# Altium schematic sheet Hex_Multiplier.SchDoc
size A; Organization: Altium Limited; Address1: L3, 12a Rodborough Rd; Address2: Frenchs Forest; Address3: NSW; Address4: Australia 2086; DocumentNumber: 1; SheetNumber: 1; SheetTotal: 1
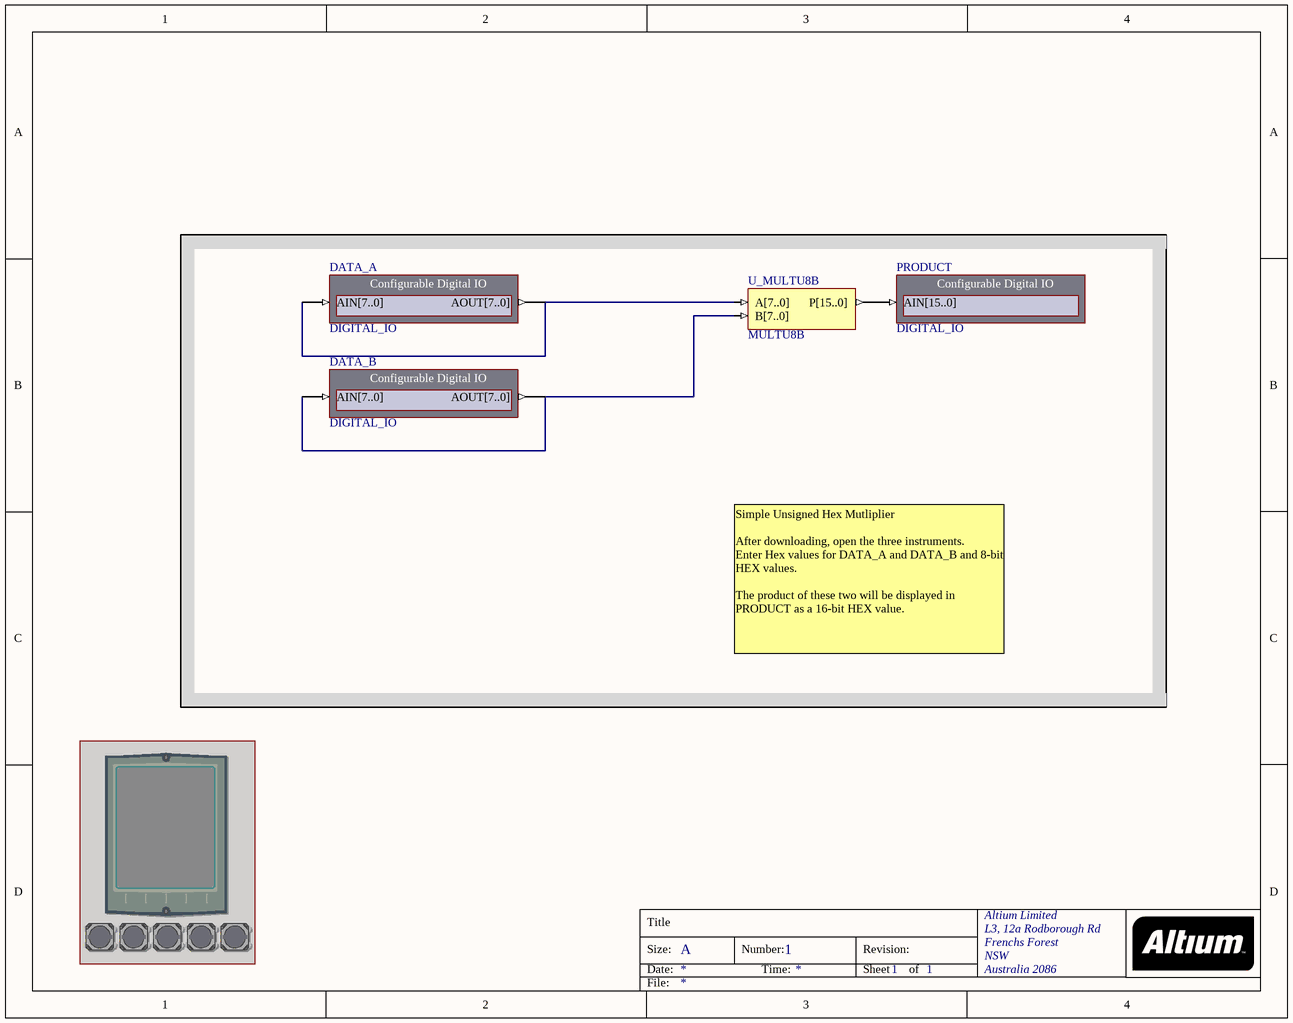
[diagram p0: Hex_Multiplier.SchDoc]

## Parts
(Parts that share a designator on the sheet are numbered #1, #2 ... from top to bottom, then left to right.)
?#1  FIRMWARE_TFT_ENABLE  (value not drawn)  (masked out: inside a compile mask, not in the netlist)
?#2  FIRMWARE_BUTTONS_ENABLE  (value not drawn)  (masked out: inside a compile mask, not in the netlist)
DATA_A  DIGITAL_IO
DATA_B  DIGITAL_IO
PRODUCT  DIGITAL_IO
U_MULTU8B  MULTU8B

## Nets
NetDATA_A_AIN[7..0]: DATA_A.AIN[7..0] DATA_A.AOUT[7..0] U_MULTU8B.A[7..0]
NetDATA_B_AIN[7..0]: DATA_B.AIN[7..0] DATA_B.AOUT[7..0] U_MULTU8B.B[7..0]
NetPRODUCT_AIN[15..0]: PRODUCT.AIN[15..0] U_MULTU8B.P[15..0]

## Notes on the sheet
- Simple Unsigned Hex Mutliplier
  After downloading, open the three instruments.
  Enter Hex values for DATA_A and DATA_B and 8-bit HEX values.
  The product of these two will be displayed in PRODUCT as a 16-bit HEX value.
- Title
- Size:
- Date:
- A
- Number:
- Time:
- Revision:
- Sheet
- of
- File:

## Library data of the parts
?#1 = FIRMWARE_TFT_ENABLE: TFT LCD Panel; PortComponent: True; Published: 22-Jan-2007; Publisher: Altium Limited; HelpURL: TR0143 Technical Reference Manual for Altium's Desktop NanoBoard NB2DSK01.pdf#page=50
?#2 = FIRMWARE_BUTTONS_ENABLE: Generic User Buttons; PortComponent: True; Published: 16-Apr-2007; Publisher: Altium Limited; HelpURL: TR0143 Technical Reference Manual for Altium's Desktop NanoBoard NB2DSK01.pdf#page=53
DATA_A DATA_B = DIGITAL_IO: Configurable Digital IO; NEXUS_CORE: Instrument; NEXUS_JTAG_DEVICE: True; NEXUS_JTAG_ORDER: 0; ConfigurationParameters: {}Version[1.0]{}Input0Name[AIN{1}7..0{2}]{}Input0Width[8]{}Input0InitValue[0]{}Input0Kind[LEDs]{}Input0LEDStyle[Red]{}Output0Name[AOUT{1}7..0{2}]{}Output0Width[8]{}Output0InitValue[0]{}Output0Kind[Numeric]{}Output0NumRadix[Binary]{}; ConfiguratorName: DIGITAL_IO; ComponentLink1Description: Core &Resource Usage; ComponentLink1URL: CR0134 FPGA Instrument Resource Usage.pdf; Core Revision: 1.00.00; HelpURL: CR0179 DIGITAL_IO Configurable Digital IO Module.pdf; LastRevisionNo: 1.00.00; Published: 28-Jun-2007; Publisher: Altium Limited; UseInDSF: True
PRODUCT = DIGITAL_IO: Configurable Digital IO; NEXUS_CORE: Instrument; NEXUS_JTAG_DEVICE: True; NEXUS_JTAG_ORDER: 0; ConfigurationParameters: {}Version[1.0]{}Input0Name[AIN{1}15..0{2}]{}Input0Width[16]{}Input0InitValue[0]{}Input0Kind[LEDs]{}Input0LEDStyle[Red]{}; ConfiguratorName: DIGITAL_IO; ComponentLink1Description: Core &Resource Usage; ComponentLink1URL: CR0134 FPGA Instrument Resource Usage.pdf; Core Revision: 1.00.00; HelpURL: CR0179 DIGITAL_IO Configurable Digital IO Module.pdf; LastRevisionNo: 1.00.00; Published: 28-Jun-2007; Publisher: Altium Limited; UseInDSF: True
U_MULTU8B = MULTU8B: 8x8 Unsigned Multiplier, Bus Version; ArchiveName: GENERIC; Published: 18-Dec-2003; Publisher: Altium Limited; Core Revision: 1.00.00